# Altium schematic sheet CAN.SchDoc
size A
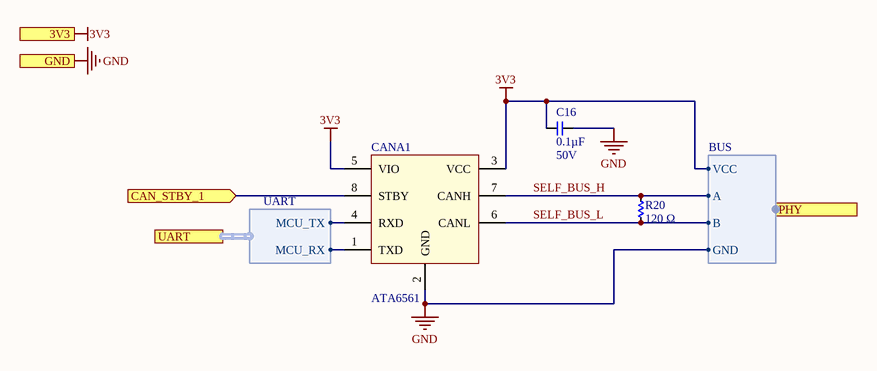
[diagram p0: CAN.SchDoc]

## Parts
C16  Capacitance (shorthand): 0.1µF  Rated Voltage: 50V  [C0603]  (hidden comment: 490-1519-1-ND)
CANA1  ATA6561  [8SOIC150]
R20  Resistance: 120 Ω  [R0603]  (hidden comment: 311-120HRCT-ND)

## Ports
3V3 (in), CAN_STBY_1 (in), GND (in), PHY (out, harness BUS), UART (harness UART)

## Harnesses
UART: MCU_RX, MCU_TX
BUS: A, B, GND, VCC

## Nets
3V3: C16.2 CANA1.3(VCC) CANA1.5(VIO) ; port 3V3, port PHY.VCC
GND: C16.1 CANA1.2(GND) ; port GND, port PHY.GND
CAN_STBY_1: CANA1.8(STBY) ; port CAN_STBY_1
SELF_BUS_H: CANA1.7(CANH) R20.2 ; port PHY.A
SELF_BUS_L: CANA1.6(CANL) R20.1 ; port PHY.B
NetCANA1_1: CANA1.1(TXD) ; port UART.MCU_RX
NetCANA1_4: CANA1.4(RXD) ; port UART.MCU_TX

## Library data of the parts
C16 = CMP-119-0065-1: CAP CER 0603 0.1µF X7R 50V 10%; Manufacturer: Murata Electronics North America; Capacitance - pF (Machine readable): #NAME?; Dielectric: X7R
CANA1 = CMP-041-0000-1: Atmel CAN Bus Transciever; Design Item ID: ATA6561; Source: ic_data_converters.SchLib
R20 = CMP-126-0077-1: RES SMD 120 OHM 1% 1/10W 0603; Manufacturer Part Number: RC0603FR-07120RL; Manufacturer: Yageo; Resistance (Sortable): 120; Power (Watts): 0.1W, 1/10W; Temperature Coefficient: ±100ppm/°C; Datasheets: http://www.yageo.com/documents/recent/PYu-RC_Group_51_RoHS_L_9.pdf; Image: //media.digikey.com/Renders/Yageo%20Renders/0603-(1608-Metric).jpg; Tolerance: ±1%; Operating Temperature: -55°C ~ 155°C